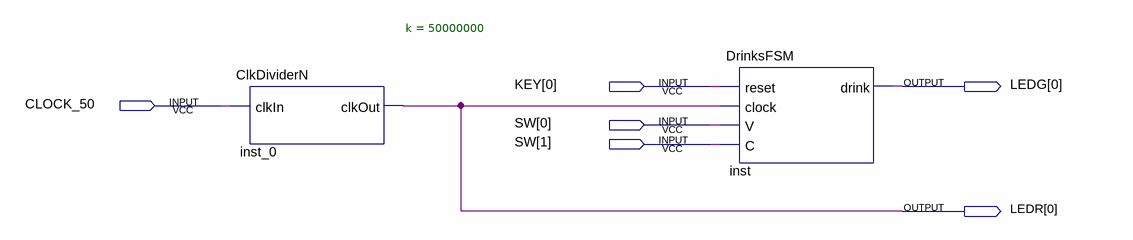
[diagram p0: schematic sheet]
// Quartus schematic DrinksMachinV2.bdf as structural Verilog: 2 symbols, 6 pins
module DrinksMachinV2 (
  input  [0:0] KEY,
  input  CLOCK_50,
  input  [1:0] SW,
  output [0:0] LEDG,
  output [0:0] LEDR
);

  ClkDividerN #(.k(50000000)) inst_0 (.clkIn(CLOCK_50), .clkOut(LEDR[0]));
  DrinksFSM inst (.reset(KEY[0]), .clock(LEDR[0]), .V(SW[0]), .C(SW[1]), .drink(LEDG[0]));
endmodule
